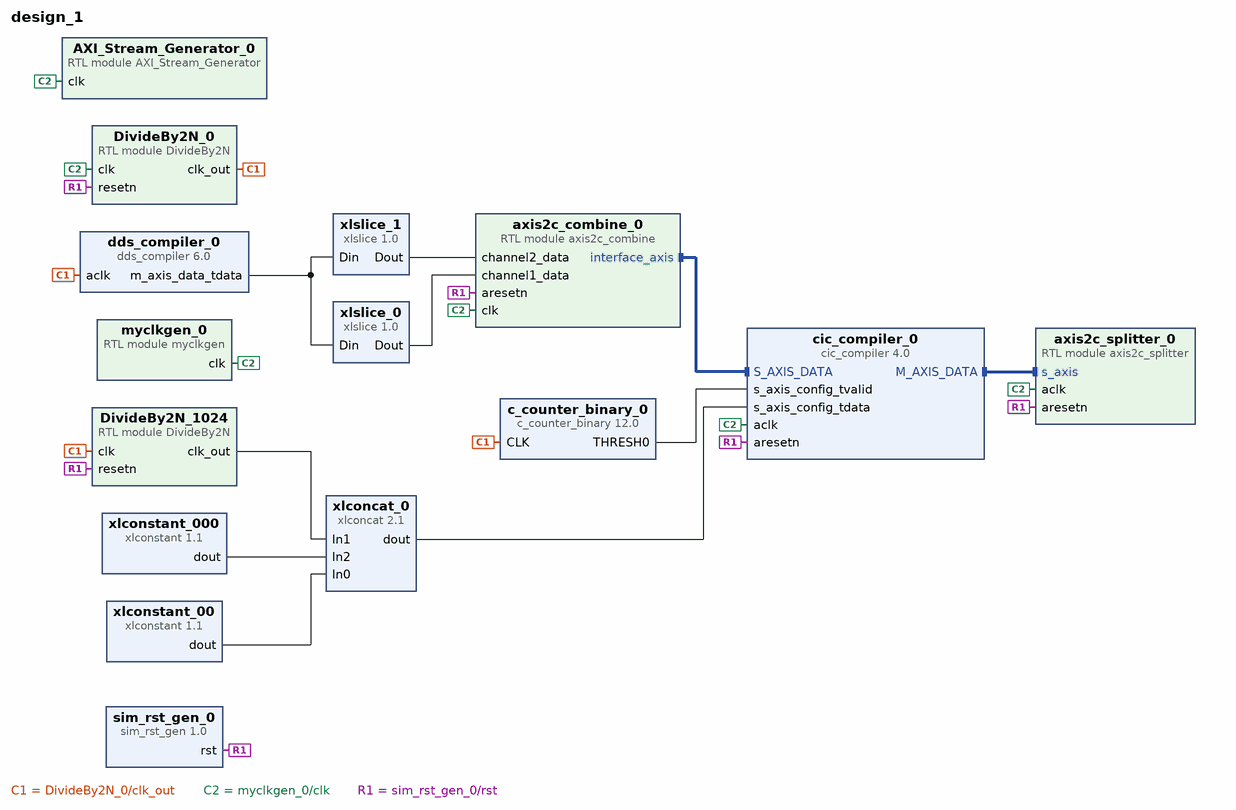
[diagram p0: block diagram of the top level]
# Vivado block design design_1, xc7z010clg400-1, Vivado 2022.2
create_bd_design design_1

create_bd_cell -type module -reference myclkgen myclkgen_0
set_property -dict {CONFIG.clk_period_nanoseconds 7} [get_bd_cells myclkgen_0]
create_bd_cell -type module -reference DivideBy2N DivideBy2N_0
set_property -dict {CONFIG.N 1 CONFIG.WIDTH 2} [get_bd_cells DivideBy2N_0]
create_bd_cell -type ip -vlnv xilinx.com:ip:dds_compiler:6.0 dds_compiler_0
set_property -dict [list \
  CONFIG.DATA_Has_TLAST Not_Required \
  CONFIG.DDS_Clock_Rate 64 \
  CONFIG.Frequency_Resolution 0.4 \
  CONFIG.Has_Phase_Out false \
  CONFIG.Latency 8 \
  CONFIG.M_DATA_Has_TUSER Not_Required \
  CONFIG.Mode_of_Operation Standard \
  CONFIG.Noise_Shaping Auto \
  CONFIG.Output_Frequency1 0.2 \
  CONFIG.Output_Width 16 \
  CONFIG.PINC1 11001100110011001100 \
  CONFIG.Parameter_Entry System_Parameters \
  CONFIG.PartsPresent Phase_Generator_and_SIN_COS_LUT \
  CONFIG.Phase_Width 28 \
  CONFIG.S_PHASE_Has_TUSER Not_Required \
  CONFIG.Spurious_Free_Dynamic_Range 95 \
] [get_bd_cells dds_compiler_0]
create_bd_cell -type ip -vlnv xilinx.com:ip:sim_rst_gen:1.0 sim_rst_gen_0
set_property -dict {CONFIG.RST_PERIOD 200} [get_bd_cells sim_rst_gen_0]
create_bd_cell -type ip -vlnv xilinx.com:ip:xlslice:1.0 xlslice_0
set_property -dict {CONFIG.DIN_FROM 31 CONFIG.DIN_TO 16} [get_bd_cells xlslice_0]
create_bd_cell -type ip -vlnv xilinx.com:ip:xlslice:1.0 xlslice_1
set_property -dict {CONFIG.DIN_FROM 15 CONFIG.DIN_TO 0} [get_bd_cells xlslice_1]
create_bd_cell -type module -reference axis2c_combine axis2c_combine_0
create_bd_cell -type module -reference axis2c_splitter axis2c_splitter_0
create_bd_cell -type ip -vlnv xilinx.com:ip:cic_compiler:4.0 cic_compiler_0
set_property -dict [list \
  CONFIG.Clock_Frequency 128 \
  CONFIG.Filter_Type Decimation \
  CONFIG.HAS_ARESETN true \
  CONFIG.Input_Data_Width 16 \
  CONFIG.Input_Sample_Frequency 64 \
  CONFIG.Maximum_Rate 1024 \
  CONFIG.Minimum_Rate 4 \
  CONFIG.Number_Of_Channels 2 \
  CONFIG.Number_Of_Stages 6 \
  CONFIG.Output_Data_Width 16 \
  CONFIG.Quantization Truncation \
  CONFIG.RateSpecification Frequency_Specification \
  CONFIG.SamplePeriod 1 \
  CONFIG.Sample_Rate_Changes Programmable \
  CONFIG.Use_Xtreme_DSP_Slice false \
] [get_bd_cells cic_compiler_0]
create_bd_cell -type module -reference DivideBy2N DivideBy2N_1024
set_property -dict {CONFIG.N 262144 CONFIG.WIDTH 18} [get_bd_cells DivideBy2N_1024]
create_bd_cell -type ip -vlnv xilinx.com:ip:xlconstant:1.1 xlconstant_000
set_property -dict {CONFIG.CONST_VAL 0 CONFIG.CONST_WIDTH 12} [get_bd_cells xlconstant_000]
create_bd_cell -type ip -vlnv xilinx.com:ip:xlconstant:1.1 xlconstant_00
set_property -dict {CONFIG.CONST_VAL 0x4 CONFIG.CONST_WIDTH 3} [get_bd_cells xlconstant_00]
create_bd_cell -type ip -vlnv xilinx.com:ip:xlconcat:2.1 xlconcat_0
set_property -dict {CONFIG.IN0_WIDTH 3 CONFIG.IN1_WIDTH 1 CONFIG.IN2_WIDTH 12 CONFIG.NUM_PORTS 3} [get_bd_cells xlconcat_0]
create_bd_cell -type ip -vlnv xilinx.com:ip:c_counter_binary:12.0 c_counter_binary_0
set_property -dict [list \
  CONFIG.CE false \
  CONFIG.Final_Count_Value 200 \
  CONFIG.Load false \
  CONFIG.Restrict_Count true \
  CONFIG.Sync_Threshold_Output true \
  CONFIG.Threshold_Value 200 \
] [get_bd_cells c_counter_binary_0]
create_bd_cell -type module -reference AXI_Stream_Generator AXI_Stream_Generator_0
set_property -dict [list \
  CONFIG.DATA_0 0x00001234 \
  CONFIG.DATA_1 0x00005678 \
  CONFIG.DATA_2 0x00009ABC \
  CONFIG.TIMEOUT_0 250 \
  CONFIG.TIMEOUT_1 100 \
  CONFIG.TIMEOUT_2 0 \
  CONFIG.TIMEOUT_3 1000 \
] [get_bd_cells AXI_Stream_Generator_0]

# ---- connections ----

connect_bd_intf_net [get_bd_intf_pins cic_compiler_0/S_AXIS_DATA] [get_bd_intf_pins axis2c_combine_0/interface_axis]
connect_bd_intf_net [get_bd_intf_pins cic_compiler_0/M_AXIS_DATA] [get_bd_intf_pins axis2c_splitter_0/s_axis]
connect_bd_net [get_bd_pins DivideBy2N_0/clk_out] \
  [get_bd_pins dds_compiler_0/aclk] [get_bd_pins c_counter_binary_0/CLK] [get_bd_pins DivideBy2N_1024/clk]
connect_bd_net [get_bd_pins DivideBy2N_1024/clk_out] [get_bd_pins xlconcat_0/In1]
connect_bd_net [get_bd_pins c_counter_binary_0/THRESH0] [get_bd_pins cic_compiler_0/s_axis_config_tvalid]
connect_bd_net -net clk_0_1 [get_bd_pins myclkgen_0/clk] \
  [get_bd_pins DivideBy2N_0/clk] [get_bd_pins axis2c_combine_0/clk] [get_bd_pins axis2c_splitter_0/aclk] \
  [get_bd_pins cic_compiler_0/aclk] [get_bd_pins AXI_Stream_Generator_0/clk]
connect_bd_net [get_bd_pins dds_compiler_0/m_axis_data_tdata] [get_bd_pins xlslice_1/Din] [get_bd_pins xlslice_0/Din]
connect_bd_net [get_bd_pins sim_rst_gen_0/rst] \
  [get_bd_pins axis2c_combine_0/aresetn] [get_bd_pins axis2c_splitter_0/aresetn] [get_bd_pins DivideBy2N_0/resetn] \
  [get_bd_pins cic_compiler_0/aresetn] [get_bd_pins DivideBy2N_1024/resetn]
connect_bd_net [get_bd_pins xlconcat_0/dout] [get_bd_pins cic_compiler_0/s_axis_config_tdata]
connect_bd_net [get_bd_pins xlconstant_000/dout] [get_bd_pins xlconcat_0/In2]
connect_bd_net -net xlconstant_16_dout [get_bd_pins xlconstant_00/dout] [get_bd_pins xlconcat_0/In0]
connect_bd_net [get_bd_pins xlslice_0/Dout] [get_bd_pins axis2c_combine_0/channel1_data]
connect_bd_net [get_bd_pins xlslice_1/Dout] [get_bd_pins axis2c_combine_0/channel2_data]

validate_bd_design
save_bd_design
